# Altium project CNEPuckRevF.PrjPcb (part 2 of 2)

## Sheet CNEPuckRevF_Drivers_2.SchDoc: Cable Node Expansion Puck
size C; Author: JDV; CompanyName: OPIsystems Inc; DrawnBy: JDV; Engineer: JDV; Organization: OPIsystems Inc; DocumentNumber: CNE; Revision: Rev F; SheetNumber: 3; SheetTotal: 3; ProjectName: Swage
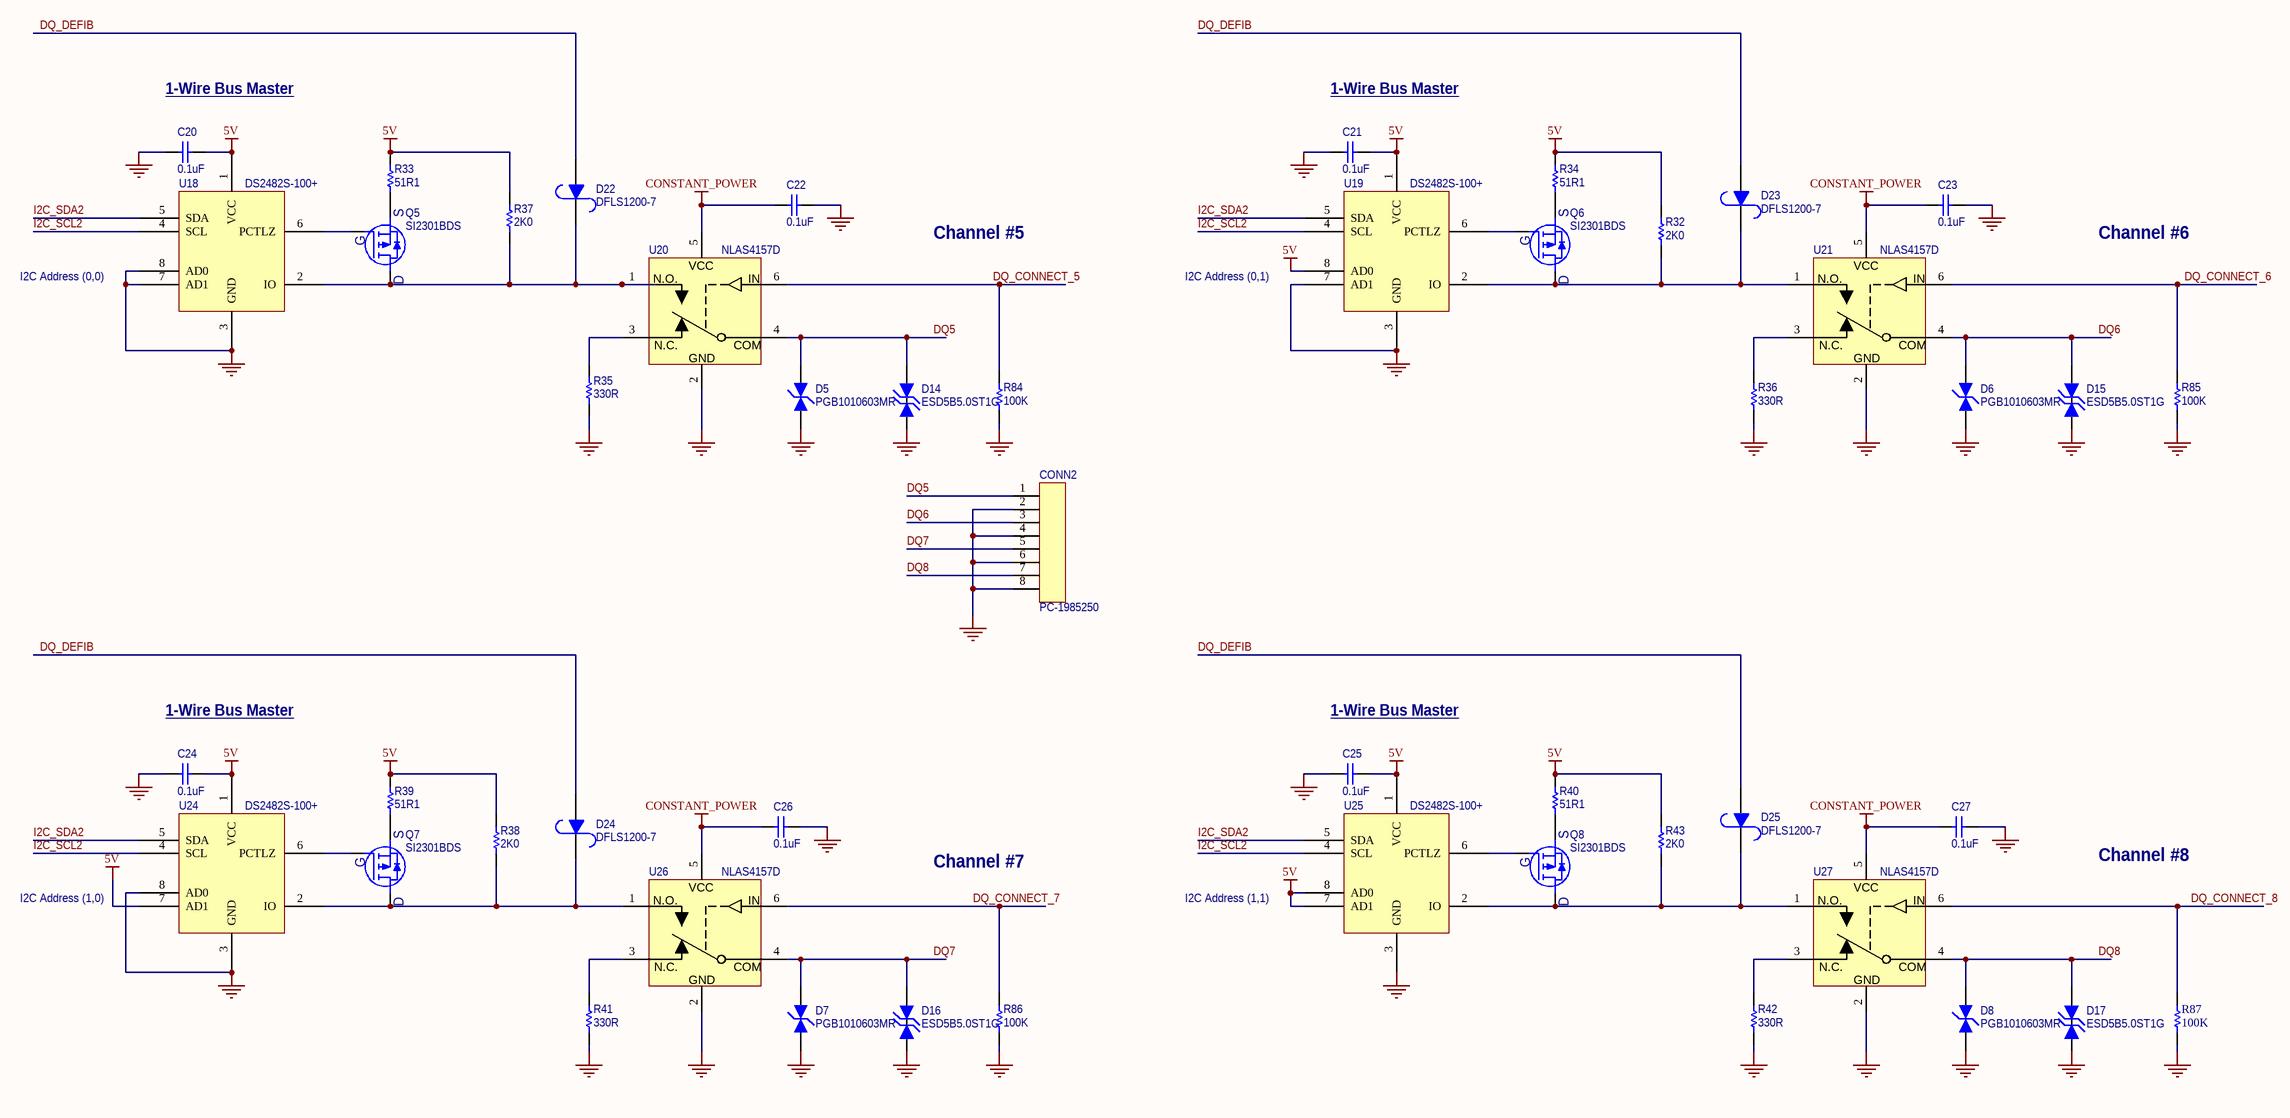
[diagram p2: CNEPuckRevF_Drivers_2.SchDoc]

### Parts
C20  0.1uF  [RC0603]
C21  0.1uF  [RC0603]
C22  0.1uF  [RC0603]
C23  0.1uF  [RC0603]
C24  0.1uF  [RC0603]
C25  0.1uF  [RC0603]
C26  0.1uF  [RC0603]
C27  0.1uF  [RC0603]
CONN2  PC-1985250  [PTSA1.5/8-3.5-Z]
D5  PGB1010603MR  [RC0603]
D6  PGB1010603MR  [RC0603]
D7  PGB1010603MR  [RC0603]
D8  PGB1010603MR  [RC0603]
D14  ESD5B5.0ST1G  [SOD-523]
D15  ESD5B5.0ST1G  [SOD-523]
D16  ESD5B5.0ST1G  [SOD-523]
D17  ESD5B5.0ST1G  [SOD-523]
D22  DFLS1200-7  [POWERDI-123]
D23  DFLS1200-7  [POWERDI-123]
D24  DFLS1200-7  [POWERDI-123]
D25  DFLS1200-7  [POWERDI-123]
Q5  SI2301BDS  [SOT23(DGS)]
Q6  SI2301BDS  [SOT23(DGS)]
Q7  SI2301BDS  [SOT23(DGS)]
Q8  SI2301BDS  [SOT23(DGS)]
R32  2K0  [RC0603]
R33  51R1  [RC0603]
R34  51R1  [RC0603]
R35  330R  [RC0805]
R36  330R  [RC0805]
R37  2K0  [RC0603]
R38  2K0  [RC0603]
R39  51R1  [RC0603]
R40  51R1  [RC0603]
R41  330R  [RC0805]
R42  330R  [RC0805]
R43  2K0  [RC0603]
R84  100K  [RC0603]
R85  100K  [RC0603]
R86  100K  [RC0603]
R87  100K  [RC0603]
U18  DS2482S-100+  [SOIC127P580X153-8N]
U19  DS2482S-100+  [SOIC127P580X153-8N]
U20  NLAS4157D  [TS5A3160]
U21  NLAS4157D  [TS5A3160]
U24  DS2482S-100+  [SOIC127P580X153-8N]
U25  DS2482S-100+  [SOIC127P580X153-8N]
U26  NLAS4157D  [TS5A3160]
U27  NLAS4157D  [TS5A3160]

### Nets
5V: C20.2 C21.2 C24.2 C25.2 R32.1 R33.1 R34.1 R37.1 R38.1 R39.1 R40.1 R43.1 U18.1(VCC) U19.1(VCC) U19.8(AD0) U24.1(VCC) U24.7(AD1) U25.1(VCC) U25.7(AD1) U25.8(AD0)
CONSTANT_POWER: C22.1 C23.1 C26.1 C27.1 U20.5 U21.5 U26.5 U27.5
GND: C20.1 C21.1 C22.2 C23.2 C24.1 C25.1 C26.2 C27.2 CONN2.2 CONN2.4 CONN2.6 CONN2.8 D5.1 D6.1 D7.1 D8.1 D14.1 D15.1 D16.1 D17.1 R35.2 R36.1 R41.2 R42.2 R84.2 R85.2 R86.2 R87.2 U18.3(GND) U18.7(AD1) U18.8(AD0) U19.3(GND) U19.7(AD1) U20.2(GND) U21.2(GND) U24.3(GND) U24.8(AD0) U25.3(GND) U26.2(GND) U27.2(GND)
DQ5: CONN2.1 D5.2 D14.2 U20.4
DQ6: CONN2.3 D6.2 D15.2 U21.4
DQ7: CONN2.5 D7.2 D16.2 U26.4
DQ8: CONN2.7 D8.2 D17.2 U27.4
DQ_CONNECT_5: R84.1 U20.6
DQ_CONNECT_6: R85.1 U21.6
DQ_CONNECT_7: R86.1 U26.6
DQ_CONNECT_8: R87.1 U27.6
DQ_DEFIB: D22.1(A) D23.1(A) D24.1(A) D25.1(A)
I2C_SCL2: U18.4(SCL) U19.4(SCL) U24.4(SCL) U25.4(SCL)
I2C_SDA2: U18.5(SDA) U19.5(SDA) U24.5(SDA) U25.5(SDA)
NetD22_2: D22.2(K) Q5.D R37.2 U18.2(IO) U20.1(NO)
NetD23_2: D23.2(K) Q6.D R32.2 U19.2(IO) U21.1(NO)
NetD24_2: D24.2(K) Q7.D R38.2 U24.2(IO) U26.1(NO)
NetD25_2: D25.2(K) Q8.D R43.2 U25.2(IO) U27.1(NO)
NetQ5_G: Q5.G U18.6(PCTLZ)
NetQ5_S: Q5.S R33.2
NetQ6_G: Q6.G U19.6(PCTLZ)
NetQ6_S: Q6.S R34.2
NetQ7_G: Q7.G U24.6(PCTLZ)
NetQ7_S: Q7.S R39.2
NetQ8_G: Q8.G U25.6(PCTLZ)
NetQ8_S: Q8.S R40.2
NetR35_1: R35.1 U20.3(NC)
NetR36_2: R36.2 U21.3(NC)
NetR41_1: R41.1 U26.3(NC)
NetR42_1: R42.1 U27.3(NC)

### Notes on the sheet
- 1-Wire Bus Master
- I2C Address (0,0)
- Channel #5
- I2C Address (0,1)
- Channel #6
- Channel #7
- Channel #8
- I2C Address (1,0)
- I2C Address (1,1)
- Title:
- OPIsystems Inc.
- Size:
- Date:
- File:
- C
- Number:
- Time:
- Revision:
- Sheet
- of
- Calgary, AB, Canada
- T2E 6M8
- 403-219-3177
- www.opisystems.com
- 1216 - 36th Avenue NE
- (in symbol NLAS4157DFT2G) VCC; N.O.; IN; N.C.; COM

### Library data of the parts
C20-C27 = 0603YC104KAT2A: CAP CERM .1UF 10% 16V X7R 0603; Manufacturer: AVX Corporation; Category 1: Capacitors; Capacitance: 0.1µF; OPI_VID: 100039; Supplier 1: Digi-Key; Supplier Part Number 1: 478-1239-2-ND; RoHS 1: RoHS Compliant; Description 1: CAP CERM .1UF 10% 16V X7R 0603; Stock 1: 5240000; Pricing 1: 4000=0.003, 12000=0.002, 24000=0.002 (USD); Voltage - Rated: 16V; Tolerance: ±10%; Temperature Coefficient: X7R; Mounting Type: Surface Mount, MLCC; Operating Temperature: -55°C ~ 125°C; Features: -; Applications: General Purpose; Ratings: -; Package / Case: 0603 (1608 Metric); Size / Dimension: 0.063" L x 0.031" W (1.60mm x 0.80mm); Thickness: 0.90mm Max; Lead Spacing: -; Packaging: Tape & Reel (TR); Lead Style: -; ComponentLink1URL: http://www.avx.com/docs/Catalogs/cx7r.pdf; ComponentLink1Description: http://www.avx.com/docs/Catalogs/cx7r.pdf; Manufacturer Part Number: 0603YC104KAT2A
CONN2 = 1985250: TERM BLOCK PCB 8POS 3.5MM GREEN; Manufacturer: Phoenix Contact; Number of Levels: 1; Positions Per Level: 8; Pitch: 0.138" (3.50mm); Mating Orientation: 45° (135°) Angle with Board; Current: 2A; Voltage: 300V; Wire Gauge: 16-24 AWG; Wire Termination: Screwless - Spring Cage, Tension Clamp; OPI_VID: 101356; Supplier 1: Digi-Key; Manufacturer Part Number: 1985250; RoHS: RoHS Compliant; Category: Connectors, Interconnects; Stock 1: 3617; Pricing 1: 1=0.9, 10=0.861, 50=0.8374, 100=0.7828, 250=0.72016, 500=0.66536 (CAD); Mounting Type: Through Hole; Features: -; Color: Green; Packaging: Bulk; Operating Temperature: -; Housing Material: Polyamide (PA), Nylon; Contact Material - Plating: -; Clamp Material - Plating: -; Screw Material - Plating: -; Torque - Screw: -; Screw Thread: -; ComponentLink1URL: http://www.phoenixcontact.com/online/portal/us/pxc/product_detail_page/!ut/p/b1/04_SjzQ0tTQ2MTMzM7TQj9CPykssy0xPLMnMz0vMAfGjzOJDnEJcXQOMzAz9A02dDDxdTJ1dfUyCDD38jIAKIvEocDQkTr8BDuBoQEh_uH4UXiUgF4AV4LHCzyM_N1U_NyrHzdJT1xEAasn7vg!!/dl4/d5/L0lDU0lKSmdrS0NsRUp; ComponentLink1Description: http://www.phoenixcontact.com/online/portal/us/pxc/product_detail_page/!ut/p/b1/04_SjzQ0tTQ2MTMzM7TQj9CPykssy0xPLMnMz0vMAfGjzOJDnEJcXQOMzAz9A02dDDxdTJ1dfUyCDD38jIAKIvEocDQkTr8BDuBoQEh_uH4UXiUgF4AV4LHCzyM_N1U_NyrHzdJT1xEAasn7vg!!/dl4/d5/L0lDU0lKSmdrS0NsRUp; Supplier Part Number 1: 277-1628-ND
D5-D8 = PGB1010603MR: SUPPRESSOR ESD 24VDC 0603 SMD; Manufacturer: Littelfuse Inc; Category 1: Circuit Protection; Voltage - Reverse Standoff (Typ): 24V; Polarization: Bidirectional; OPI_VID: 101020; Supplier 1: Digi-Key; Supplier Part Number 1: F3591TR-ND; RoHS 1: RoHS Compliant; Description 1: SUPPRESSOR ESD 24VDC 0603 SMD; Stock 1: 10000; Pricing 1: 5000=0.189, 10000=0.176, 25000=0.166 (USD); Voltage - Breakdown: -; Mounting Type: Surface Mount; Package / Case: 0603 (1608 Metric); Supplier Device Package: 0603 (1608 Metric); Packaging: Tape & Reel (TR); ComponentLink1URL: http://www.littelfuse.com/data/en/Data_Sheets/Littelfuse_PulseGuard-ESD_PGB1.pdf; ComponentLink1Description: http://www.littelfuse.com/data/en/Data_Sheets/Littelfuse_PulseGuard-ESD_PGB1.pdf; Manufacturer Part Number: PGB1010603MR
D14-D17 = ESD5B5.0ST1G: TVS BIDIRECT 50W SOD523; Manufacturer: ON Semiconductor; Voltage - Reverse Standoff (Typ): 5V; Voltage - Breakdown: 5.8V; Polarization: Bidirectional; OPI_VID: 101019; Supplier 1: Digi-Key; Supplier Part Number 1: ESD5B5.0ST1GOSTR-ND; Manufacturer Part Number: ESD5B5.0ST1G; RoHS: RoHS Compliant; Category: Circuit Protection; Stock 1: 240000; Pricing 1: 3000=0.06935, 6000=0.06253, 12000=0.05571, 24000=0.0523, 48000=0.04661, 96000=0.04548 (CAD); Power (Watts): 50W; Mounting Type: Surface Mount; Package / Case: SC-79, SOD-523; Supplier Device Package: SOD-523; Packaging: Tape & Reel (TR); ComponentLink1URL: http://www.onsemi.com/pub_link/Collateral/ESD5B5.0ST1G.PDF; ComponentLink1Description: http://www.onsemi.com/pub_link/Collateral/ESD5B5.0ST1G.PDF
D22-D25 = DFLS1200-7: DIODE SCHOTTKY 1A 200V PWRDI 123; Manufacturer: Diodes Inc; Voltage - Forward (Vf) (Max) @ If: 850mV @ 1A; Speed: Fast Recovery =< 500ns, > 200mA (Io); Current - Reverse Leakage @ Vr: 2µA @ 200V; Capacitance @ Vr, F: 23pF @ 5V, 1MHz; OPI_VID: 101018; Supplier 1: Digi-Key; Supplier Part Number 1: DFLS1200DITR-ND; Manufacturer Part Number: DFLS1200-7; RoHS: RoHS Compliant; Category: Discrete Semiconductor Products; Stock 1: 21000; Pricing 1: 3000=0.22411, 6000=0.21017, 12000=0.19516, 27000=0.18444, 51000=0.18122 (CAD); Diode Type: Schottky; Voltage - DC Reverse (Vr) (Max): 200V; Current - Average Rectified (Io): 1A; Reverse Recovery Time (trr): -; Mounting Type: Surface Mount; Package / Case: 2-SMD, Flat Lead; Supplier Device Package: PowerDI™ 123; Packaging: Tape & Reel (TR); ComponentLink1URL: http://www.diodes.com/datasheets/ds30628.pdf; ComponentLink1Description: http://www.diodes.com/datasheets/ds30628.pdf
Q5-Q8 = SI2301BDS-T1-E3: MOSFET P-CH 20V 2.2A SOT23-3; Manufacturer: Vishay/Siliconix; FET Type: MOSFET P-Channel, Metal Oxide; FET Feature: Logic Level Gate; Rds On (Max) @ Id, Vgs: 100 mOhm @ 2.8A, 4.5V; Vgs(th) (Max) @ Id: 950mV @ 250µA; Gate Charge (Qg) @ Vgs: 10nC @ 4.5V; Input Capacitance (Ciss) @ Vds: 375pF @ 6V; Power - Max: 700mW; OPI_VID: 100638; Supplier 1: Digi-Key; Supplier Part Number 1: SI2301BDS-T1-E3TR-ND; Manufacturer Part Number: SI2301BDS-T1-E3; RoHS: RoHS Compliant; Category: Discrete Semiconductor Products; Stock 1: 27000; Pricing 1: 3000=0.18924, 6000=0.17754, 12000=0.16479, 27000=0.15628, 51000=0.15309 (CAD); Drain to Source Voltage (Vdss): 20V; Current - Continuous Drain (Id) @ 25° C: 2.2A; Mounting Type: Surface Mount; Package / Case: TO-236-3, SC-59, SOT-23-3; Supplier Device Package: SOT-23-3 (TO-236); Packaging: Tape & Reel (TR); ComponentLink1URL: http://www.vishay.com/doc?72066; ComponentLink1Description: http://www.vishay.com/doc?72066
R32 R37 R38 R43 = ERJ-3EKF2001V: RES 2K OHM 1/10W 1% 0603 SMD; Manufacturer: Panasonic Electronic Components; Power (Watts): 0.1W, 1/10W; Temperature Coefficient: ±100ppm/°C; OPI_VID: 101487; Supplier 1: Digi-Key; Supplier Part Number 1: P2.00KHTR-ND; Manufacturer Part Number: ERJ-3EKF2001V; RoHS: RoHS Compliant; Category: Resistors; Stock 1: 1000000; Pricing 1: 5000=0.00272, 10000=0.00236, 25000=0.00207, 50000=0.0019, 125000=0.00186 (CAD); Packaging: Tape & Reel (TR); Resistance (Ohms): 2k; Composition: Thick Film; Features: -; Tolerance: ±1%; Package / Case: 0603 (1608 Metric); Supplier Device Package: 0603; Size / Dimension: 0.063" L x 0.031" W (1.60mm x 0.80mm); Height: 0.022" (0.55mm); Number of Terminations: 2; ComponentLink1URL: http://industrial.panasonic.com/www-cgi/jvcr13pz.cgi?E+PZ+3+AOA0002+ERJ3EKF2001V+7+WW; ComponentLink1Description: http://industrial.panasonic.com/www-cgi/jvcr13pz.cgi?E+PZ+3+AOA0002+ERJ3EKF2001V+7+WW
R33 R34 R39 R40 = CRCW060351R1FKEAHP: RES 51.1 OHM .25W 1% 0603 SMD; Manufacturer: Vishay Dale; Resistance (Ohms): 51.1; Power (Watts): 0.25W, 1/4W; Temperature Coefficient: ±100ppm/°C; OPI_VID: 101449; Supplier 1: Digi-Key; Manufacturer Part Number: CRCW060351R1FKEAHP; RoHS: RoHS Compliant; Category: Resistors; Stock 1: 5000; Pricing 1: 5000=0.0351, 10000=0.03159, 25000=0.02808, 50000=0.0234, 100000=0.01942, 250000=0.01755, 500000=0.0158 (USD); Composition: Thick Film; Features: Automotive AEC-Q200 Qualified, Pulse Withstanding; Tolerance: ±1%; Package / Case: 0603 (1608 Metric); Supplier Device Package: 0603 (1608 Metric); Size / Dimension: 0.063" L x 0.033" W (1.60mm x 0.85mm); Height: 0.022" (0.55mm); Number of Terminations: 2; Packaging: Tape & Reel (TR); ComponentLink1URL: http://www.vishay.com/docs/20043/crcwhpe3.pdf; ComponentLink1Description: http://www.vishay.com/docs/20043/crcwhpe3.pdf; Supplier Part Number 1: 541-51.1STR-ND
R35 R36 R41 R42 = ERJ-6GEYJ331V: RES 330 OHM 1/8W 5% 0805 SMD; Manufacturer: KOA Speer Technologies; Manufacturer Part Number: RK73B2ATTD331J; Resistance (Ohms): 330; Power (Watts): 0.125W, 1/8W; Temperature Coefficient: ±200ppm/°C; OPI_VID: 101386; Supplier 1: Digi-Key; RoHS: RoHS Compliant; Category: Resistors; Stock 1: 895000; Pricing 1: 5000=0.00304, 10000=0.00264, 25000=0.00232, 50000=0.00213, 125000=0.00208 (CAD); Composition: Thick Film; Features: -; Tolerance: ±5%; Package / Case: 0805 (2012 Metric); Size / Dimension: 0.079" L x 0.049" W (2.00mm x 1.25mm); Height: 0.028" (0.70mm); Number of Terminations: 2; Packaging: Tape & Reel (TR); ComponentLink1URL: http://industrial.panasonic.com/www-cgi/jvcr13pz.cgi?E+PZ+3+AOA0001+ERJ6GEYJ331V+7+WW; ComponentLink1Description: http://industrial.panasonic.com/www-cgi/jvcr13pz.cgi?E+PZ+3+AOA0001+ERJ6GEYJ331V+7+WW; Supplier Part Number 1: P330ATR-ND
R84-R87 = ERJ-3GEYJ104V: RES 100K OHM 1/10W 5% 0603 SMD; Manufacturer: Panasonic Electronic Components; Power (Watts): 0.1W, 1/10W; Temperature Coefficient: ±200ppm/°C; OPI_VID: 101335; Supplier 1: Digi-Key; Manufacturer Part Number: ERJ-3GEYJ104V; RoHS: RoHS Compliant; Category: Resistors; Stock 1: 3755000; Pricing 1: 5000=0.00172, 10000=0.00149, 25000=0.00131, 50000=0.0012, 125000=0.00118 (CAD); Resistance (Ohms): 100k; Composition: Thick Film; Features: -; Tolerance: ±5%; Package / Case: 0603 (1608 Metric); Size / Dimension: 0.063" L x 0.031" W (1.60mm x 0.80mm); Height: 0.022" (0.55mm); Number of Terminations: 2; Packaging: Tape & Reel (TR); ComponentLink1URL: http://industrial.panasonic.com/www-cgi/jvcr13pz.cgi?E+PZ+3+AOA0001+ERJ3GEYJ104V+7+WW; ComponentLink1Description: http://industrial.panasonic.com/www-cgi/jvcr13pz.cgi?E+PZ+3+AOA0001+ERJ3GEYJ104V+7+WW; Supplier Part Number 1: P100KGTR-ND
U18 U19 U24 U25 = DS2482S-100+: IC BRIDGE I2C TO 1-WIRE 8-SOIC; Manufacturer: Maxim Integrated; Controller Type: I²C Bus Controller; Interface: I²C; Voltage - Supply: 3.3V, 5V; Current - Supply: 750µA; OPI_VID: 101350; Supplier 1: Digi-Key; Manufacturer Part Number: DS2482S-100+; RoHS: RoHS Compliant; Category: Integrated Circuits (ICs); Stock 1: 830; Pricing 1: 1=1.79, 25=1.1904, 100=0.8686, 1000=0.77314 (CAD); Operating Temperature: -40°C ~ 85°C; Mounting Type: Surface Mount; Package / Case: 8-SOIC (0.154", 3.90mm Width); Supplier Device Package: 8-SOIC; Packaging: Tube; ComponentLink1URL: http://datasheets.maxim-ic.com/en/ds/DS2482-100.pdf; ComponentLink1Description: http://datasheets.maxim-ic.com/en/ds/DS2482-100.pdf; Supplier Part Number 1: DS2482S-100+-ND
U20 U21 U26 U27 = NLAS4157DFT2G: IC SWITCH SPDT SC88; Manufacturer: ON Semiconductor; Circuit: 1 x SPDT; On-State Resistance: 1.15 Ohm; Voltage Supply Source: Single Supply; Voltage - Supply, Single/Dual (±): 1.65 V ~ 5.5 V; Current - Supply: 500nA; OPI_VID: 101351; Supplier 1: Digi-Key; Manufacturer Part Number: NLAS4157DFT2G; RoHS: RoHS Compliant; Category: Integrated Circuits (ICs); Stock 1: 3000; Pricing 1: 3000=0.15291, 6000=0.14305, 15000=0.13318, 30000=0.12628, 75000=0.12332, 150000=0.11838 (CAD); Function: Switch; Operating Temperature: -40°C ~ 85°C; Mounting Type: Surface Mount; Package / Case: 6-TSSOP, SC-88, SOT-363; Supplier Device Package: SC-88; Packaging: Tape & Reel (TR); ComponentLink1URL: http://www.onsemi.com/pub_link/Collateral/NLAS4157-D.PDF; ComponentLink1Description: http://www.onsemi.com/pub_link/Collateral/NLAS4157-D.PDF; Supplier Part Number 1: NLAS4157DFT2GOSTR-ND

## Nets that join several sheets
5V: CNEPuckCPURevF (13 pins), CNEPuckRevF_Drivers_1 (22 pins), CNEPuckRevF_Drivers_2 (20 pins)
CONSTANT_POWER: CNEPuckCPURevF (D26.3 R17.2), CNEPuckRevF_Drivers_1 (8 pins), CNEPuckRevF_Drivers_2 (8 pins)
GND: CNEPuckCPURevF (36 pins), CNEPuckRevF_Drivers_1 (41 pins), CNEPuckRevF_Drivers_2 (40 pins)
DQ_CONNECT_1: CNEPuckCPURevF (RA1.8), CNEPuckRevF_Drivers_1 (R80.1 U5.6)
DQ_CONNECT_2: CNEPuckCPURevF (RA1.7), CNEPuckRevF_Drivers_1 (R81.1 U6.6)
DQ_CONNECT_3: CNEPuckCPURevF (RA1.6), CNEPuckRevF_Drivers_1 (R82.1 U11.6)
DQ_CONNECT_4: CNEPuckCPURevF (RA1.5), CNEPuckRevF_Drivers_1 (R83.1 U12.6)
DQ_CONNECT_5: CNEPuckCPURevF (RA2.8), CNEPuckRevF_Drivers_2 (R84.1 U20.6)
DQ_CONNECT_6: CNEPuckCPURevF (RA2.7), CNEPuckRevF_Drivers_2 (R85.1 U21.6)
DQ_CONNECT_7: CNEPuckCPURevF (RA3.7), CNEPuckRevF_Drivers_2 (R86.1 U26.6)
DQ_CONNECT_8: CNEPuckCPURevF (RA2.6), CNEPuckRevF_Drivers_2 (R87.1 U27.6)
DQ_DEFIB: CNEPuckRevF_Drivers_1 (5 pins), CNEPuckRevF_Drivers_2 (D22.1 D23.1 D24.1 D25.1)
DQ_DEFIB_MASTER: CNEPuckCPURevF (U13.39), CNEPuckRevF_Drivers_1 (U1.5)
I2C_SCL1: CNEPuckCPURevF (R55.2 U17.6), CNEPuckRevF_Drivers_1 (U3.4 U4.4 U9.4 U10.4)
I2C_SCL2: CNEPuckCPURevF (R52.2 U16.6), CNEPuckRevF_Drivers_2 (U18.4 U19.4 U24.4 U25.4)
I2C_SDA1: CNEPuckCPURevF (R56.2 U17.5), CNEPuckRevF_Drivers_1 (U3.5 U4.5 U9.5 U10.5)
I2C_SDA2: CNEPuckCPURevF (R53.2 U16.5), CNEPuckRevF_Drivers_2 (U18.5 U19.5 U24.5 U25.5)

## Assembly variants
Variant to Contract Manufacturer: not fitted CANADAFLAG1 FD1 FD2 FD3 MH1 MH2 MH3 P1 P2 P3 R17 R23